# Altium schematic sheet DC-DC-Converters 3.SchDoc
size A3
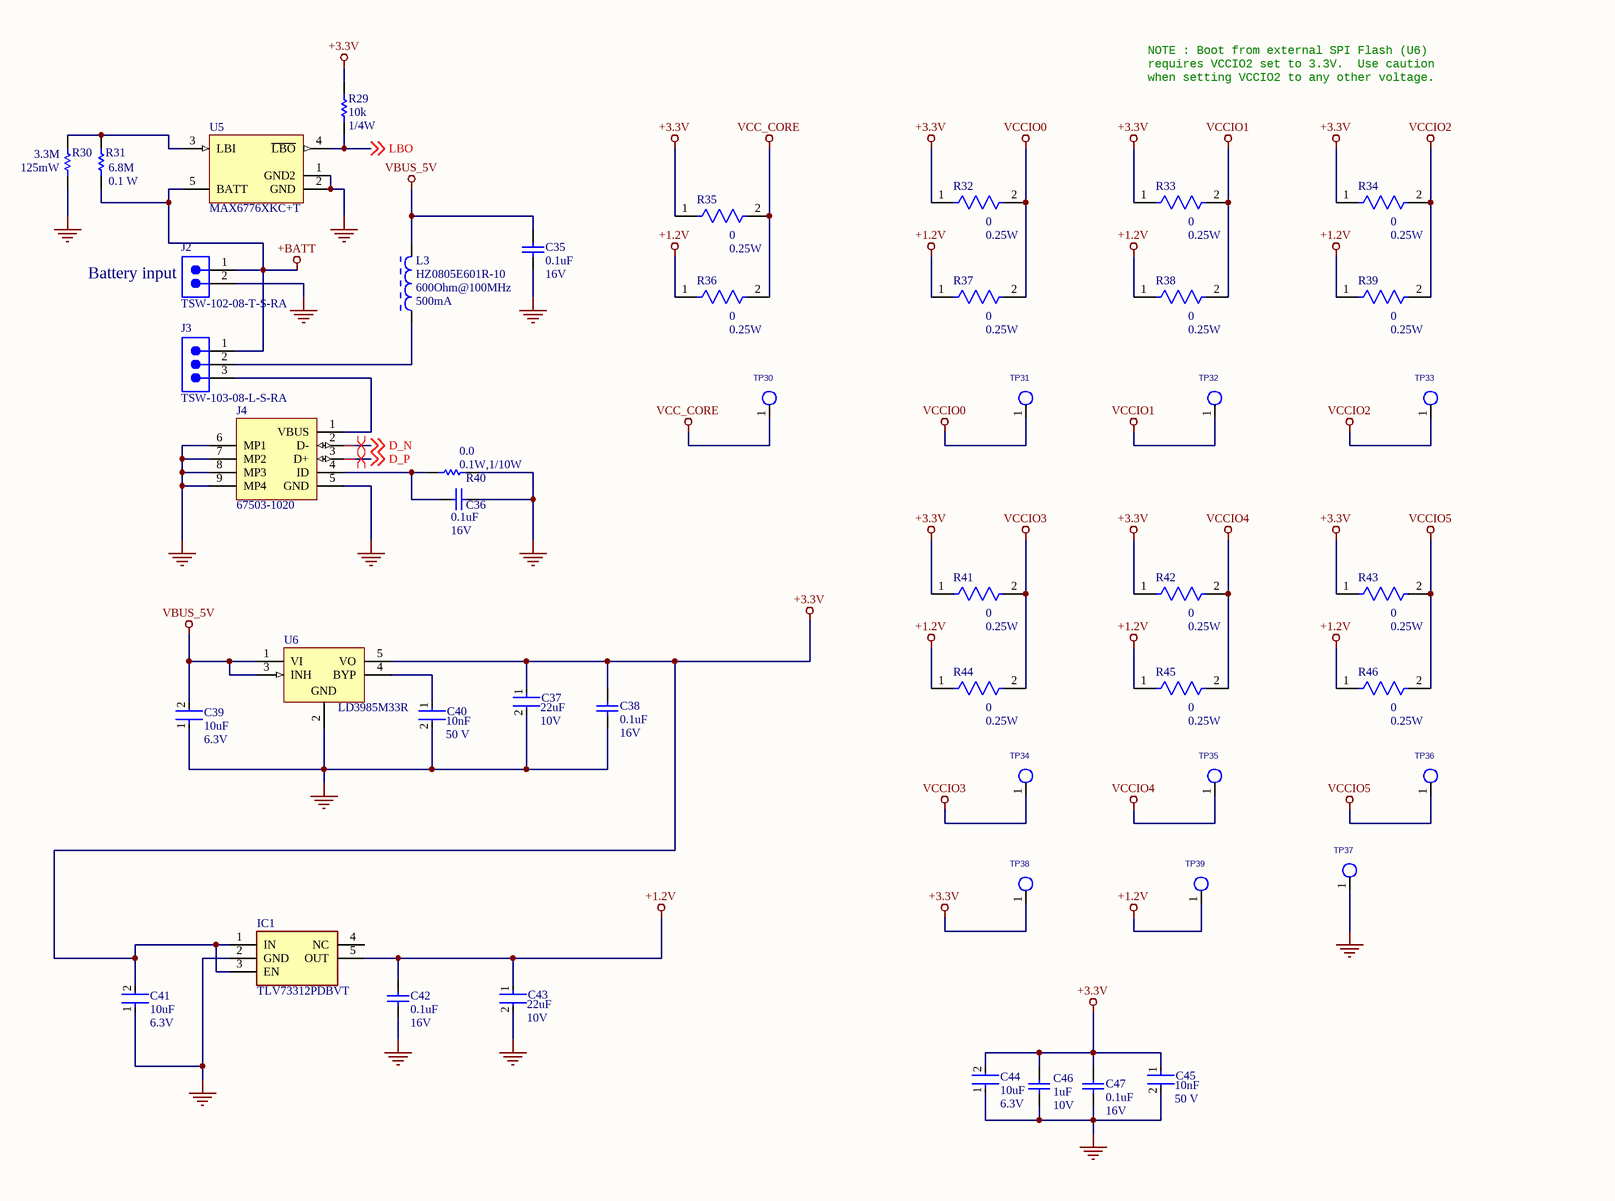
[diagram p0: DC-DC-Converters 3.SchDoc]

## Parts
C35  value 0.1uF  Voltage: 16V  [CAPC1608X87X35ML15T15]  (hidden comment: C0603C104M4RACTU)
C36  value 0.1uF  Voltage: 16V  [CAPC1608X87X35ML15T15]  (hidden comment: C0603C104M4RACTU)
C37  value 22uF  Voltage: 10V  [FP-GRM188-0_2-IPC_C]  (hidden comment: GRM188R61A226ME15D)
C38  value 0.1uF  Voltage: 16V  [CAPC1608X87X35ML15T15]  (hidden comment: C0603C104M4RACTU)
C39  value 10uF  Voltage: 6.3V  [FP-CL10-IPC_C]  (hidden comment: CL10A106MQ8NNNC)
C40  value 10nF  Voltage: 50 V  [FP-C0805C-DN-MFG]  (hidden comment: C0805C103K5RACAUTO)
C41  value 10uF  Voltage: 6.3V  [FP-CL10-IPC_C]  (hidden comment: CL10A106MQ8NNNC)
C42  value 0.1uF  Voltage: 16V  [CAPC1608X87X35ML15T15]  (hidden comment: C0603C104M4RACTU)
C43  value 22uF  Voltage: 10V  [FP-GRM188-0_2-IPC_C]  (hidden comment: GRM188R61A226ME15D)
C44  value 10uF  Voltage: 6.3V  [FP-CL10-IPC_C]  (hidden comment: CL10A106MQ8NNNC)
C45  value 10nF  Voltage: 50 V  [FP-C0805C-DN-MFG]  (hidden comment: C0805C103K5RACAUTO)
C46  value 1uF  Voltage: 10V  [CAPC1608X90X35ML15T15]  (hidden comment: C0603C105K8RACTU)
C47  value 0.1uF  Voltage: 16V  [CAPC1608X87X35ML15T15]  (hidden comment: C0603C104M4RACTU)
IC1  TLV73312PDBVT  [SOT95P280X145-5N]
J2  TSW-102-08-T-S-RA  [SMTC-TSW-102-08-X-S-RA]
J3  TSW-103-08-L-S-RA  [SMTC-TSW-103-08-X-S-RA]
J4  67503-1020  [MOLX-67503-1020_V]
L3  HZ0805E601R-10  Impedance @ Frequency: 600Ohm@100MHz  Current Rating (Max): 500mA  [LIRD-LI0805H151R-10-2_V]
R29  value 10k  Power: 1/4W  [RESC3216X70X50NL05T20]  (hidden comment: ERJ-8GEYJ103V)
R30  value 3.3M  Power: 125mW  [RESC2013X50X30LL20T20]  (hidden comment: CRCW08053M30FKEA)
R31  value 6.8M  Power: 0.1 W  [RESC0603(1608)_L]  (hidden comment: 6M8 5% 0603(1608))
R32  value 0  Power: 0.25W  [FP-RC1206-MFG]  (hidden comment: RC1206JR-070RL)
R33  value 0  Power: 0.25W  [FP-RC1206-MFG]  (hidden comment: RC1206JR-070RL)
R34  value 0  Power: 0.25W  [FP-RC1206-MFG]  (hidden comment: RC1206JR-070RL)
R35  value 0  Power: 0.25W  [FP-RC1206-MFG]  (hidden comment: RC1206JR-070RL)
R36  value 0  Power: 0.25W  [FP-RC1206-MFG]  (hidden comment: RC1206JR-070RL)
R37  value 0  Power: 0.25W  [FP-RC1206-MFG]  (hidden comment: RC1206JR-070RL)
R38  value 0  Power: 0.25W  [FP-RC1206-MFG]  (hidden comment: RC1206JR-070RL)
R39  value 0  Power: 0.25W  [FP-RC1206-MFG]  (hidden comment: RC1206JR-070RL)
R40  value 0.0  Power: 0.1W,1/10W  [RESC1608X55X35LL10T10]  (hidden comment: RC1608J000CS)
R41  value 0  Power: 0.25W  [FP-RC1206-MFG]  (hidden comment: RC1206JR-070RL)
R42  value 0  Power: 0.25W  [FP-RC1206-MFG]  (hidden comment: RC1206JR-070RL)
R43  value 0  Power: 0.25W  [FP-RC1206-MFG]  (hidden comment: RC1206JR-070RL)
R44  value 0  Power: 0.25W  [FP-RC1206-MFG]  (hidden comment: RC1206JR-070RL)
R45  value 0  Power: 0.25W  [FP-RC1206-MFG]  (hidden comment: RC1206JR-070RL)
R46  value 0  Power: 0.25W  [FP-RC1206-MFG]  (hidden comment: RC1206JR-070RL)
TP30  tp_s_40_63  [tp_s_40_63]  (value not drawn)
TP31  tp_s_40_63  [tp_s_40_63]  (value not drawn)
TP32  tp_s_40_63  [tp_s_40_63]  (value not drawn)
TP33  tp_s_40_63  [tp_s_40_63]  (value not drawn)
TP34  tp_s_40_63  [tp_s_40_63]  (value not drawn)
TP35  tp_s_40_63  [tp_s_40_63]  (value not drawn)
TP36  tp_s_40_63  [tp_s_40_63]  (value not drawn)
TP37  tp_s_40_63  [tp_s_40_63]  (value not drawn)
TP38  tp_s_40_63  [tp_s_40_63]  (value not drawn)
TP39  tp_s_40_63  [tp_s_40_63]  (value not drawn)
U5  MAX6776XKC+T  [X5+1_N]
U6  LD3985M33R  [SOT23-5L_N]

## Nets
+1.2V: C42.1 C43.1 IC1.5(OUT) R36.1 R37.1 R38.1 R39.1 R44.1 R45.1 R46.1 TP39.1(TP)
+3.3V: C37.1 C38.1 C41.2 C44.2 C45.1 C46.2 C47.1 IC1.1(IN) IC1.3(EN) R29.1 R32.1 R33.1 R34.1 R35.1 R41.1 R42.1 R43.1 TP38.1(TP) U6.5(VO)
+BATT: J2.1 J3.1 R31.1 U5.5(BATT)
GND: C35.2 C36.1 C37.2 C38.2 C39.1 C40.2 C41.1 C42.2 C43.2 C44.1 C45.2 C46.1 C47.2 IC1.2(GND) J2.2 J4.5(GND) J4.6(MP1) J4.7(MP2) J4.8(MP3) J4.9(MP4) R30.1 R40.2 TP37.1(TP) U5.1(GND2) U5.2(GND) U6.2(GND)
VBUS_5V: C35.1 C39.2 L3.2 U6.1(VI) U6.3(INH)
VCC_CORE: R35.2 R36.2 TP30.1(TP)
VCCIO0: R32.2 R37.2 TP31.1(TP)
VCCIO1: R33.2 R38.2 TP32.1(TP)
VCCIO2: R34.2 R39.2 TP33.1(TP)
VCCIO3: R41.2 R44.2 TP34.1(TP)
VCCIO4: R42.2 R45.2 TP35.1(TP)
VCCIO5: R43.2 R46.2 TP36.1(TP)
D_N: J4.2(D-) ; off-sheet D_N
D_P: J4.3(D+) ; off-sheet D_P
LBO: R29.2 U5.4(~{LBO}) ; off-sheet LBO
NetC36_2: C36.2 J4.4(ID) R40.1
NetC40_1: C40.1 U6.4(BYP)
NetJ3_2: J3.2 L3.1
NetJ3_3: J3.3 J4.1(VBUS)
NetR30_2: R30.2 R31.2 U5.3(LBI)

Not connected (* = marked no-connect by the designer): IC1 4(NC)

## Layout directives
differential pair; differential pair class USB; rule Differential Pairs Routing [Pref Gap = 10mil    Min Gap  = 10mil    Max Gap  = 10milPref Width = 14.334mil    Min Width  = 14.334mil    Max Width  = 15mil]: D_N, D_P

## Notes on the sheet
- NOTE : Boot from external SPI Flash (U6)
  requires VCCIO2 set to 3.3V.  Use caution
  when setting VCCIO2 to any other voltage.
- (near J2) Battery input
- Title
- Size:
- Date:
- A3
- Number:
- Time:
- Revision:
- Sheet
- of
- File:

## Library data of the parts
C35 C36 C38 C42 C47 = CMP-2006-03067-1: Ceramic Capacitor 0.1uF 16V +-10% X7R0603; Manufacturer: Kemet; Alternative1: C1608X7R1E104K TDK; Alternative2: CC0603KRX7R8BB104 Yageo; Alternative3: GRM188R72A104KA35D Murata; Part Number: C0603C104M4RACTU; Package / Case: 0603
C37 C43 = CMP-06035-000033-2: Chip Multilayer Ceramic Capacitors for General Purpose, 0603, 22uF, X5R, 15%, 20%, 10V; Alternative1: GRM21BR72A103KA01L Murata; Alternative2: C0805F103K5RACTU KEMET; Alternative3: 08055C103JAT2A Kyocera AVX; Tolerance: 20%; Material: Ceramic; Termination: SMD/SMT; Packaging: Tape and Reel; Width: 0.8mm; Case Code (Imperial): 0603; Mount: Surface Mount; Package / Case: 0603; Dielectric: X5R; Package Quantity: 4000; Case Code (Metric): 1608; Min Operating Temperature: -55°C; Lead Free: Lead Free; Max Operating Temperature: 85°C; Part Number: GRM188R61A226ME15D
C39 C41 C44 = CMP-13271-001938-1: Cap Ceramic 10uF 6.3V X5R ±20% Pad SMD 0603 +85°C T/R; Manufacturer: Samsung; Alternative1: LMK107BJ106MALTD Taiyo Yuden; Alternative2: C1608X5R0J106K080AB TDK; Alternative3: 06036D106MAT2A Kyocera AVX; Height: 0.8mm; Width: 0.031inch; Min Operating Temperature: -55°C; Dielectric: X5R; Package / Case: 0603; Radiation Hardening: No; Packaging: Tape and Reel; Max Operating Temperature: 85°C; Thickness: 0.035inch; Mount: Surface Mount; Case Code (Imperial): 0603; Case Code (Metric): 1608; Depth: 0.8mm; Tolerance: 20%; Length: 1.6mm; Part Number: CL10A106MQ8NNNC
C40 C45 = CMP-03020-006206-1: CAP CER 10000PF 50V X7R 0805; Manufacturer: KEMET; Material: Ceramic; Temperature Coefficient: 30ppm/°C; Alternative1: GRM21BR72A103KA01L Murata; Alternative2: C0805F103K5RACTU KEMET; Alternative3: 08055C103JAT2A Kyocera AVX; Height: 0.88mm; Temperature Characteristic: X7R; Part Number: C0805C103K5RACAUTO; ComponentLink2URL: https://content.kemet.com/datasheets/KEM_C1003_C0G_SMD.pdf; RoHS: TRUE; Temperature: -55°C to +125°C; Temperature Range Low: -55°C; ComponentLink2Description: Datasheet; Package / Case: C0805C-DN; Lead Free: Yes
C46 = CMP-2006-02293-1: Manufacturer: Kemet; Alternative1: CL10B105KO8NNND Samsung; Alternative2: CC0603KPX7R7BB105 Yageo; Alternative3: GRM188R71C105KE15D Murata; Part Number: C0603C105K8RACTU; Package / Case: 0603
IC1 = TLV73312PDBVT: Integrated Circuit; Manufacturer_Name: Texas Instruments; Datasheet Link: http://www.ti.com/lit/gpn/TLV733P; Height: 1.45mm; Manufacturer_Part_Number: TLV73312PDBVT; Arrow Part Number: TLV73312PDBVT; Arrow Price/Stock: https://www.arrow.com/en/products/tlv73312pdbvt/texas-instruments; Mouser Part Number: 595-TLV73312PDBVT; Mouser Price/Stock: https://www.mouser.co.uk/ProductDetail/Texas-Instruments/TLV73312PDBVT?qs=ifm8N2KdrcbA2G38xADqCw%3D%3D
J2 = CMP-1024-00319-1: 0.025" SQ Post Header, Through-hole, Right Angle, -55 to 105 degC, 2.54 mm Pitch, 2-Pin, Male, RoHS; Manufacturer: Samtec; Pitch: 2.54 mm; ComponentLink1Description: Manufacturer URL; ComponentLink1URL: http://www.samtec.com; ComponentLink2Description: Datasheet; ComponentLink2URL: http://www.samtec.com/documents/webfiles/pdf/TSW_TH.PDF; Mounting Technology: Through-hole; Temperature Range: -55 to 105 degC; PackageDescription: .025[0.64] SQ. Post Terminal Strip Assembly; PackageVersion: DM, 8/1988; PartNumber: TSW-102-08-T-S-RA; Orientation: Right Angle; ComponentLink3URL: http://www.samtec.com/documents/webfiles/cpdf/TSW-XXX-XX-XXX-X-XX-XXX-MKT.pdf; RoHS: True; ComponentLink3Description: Package Specification; DatasheetVersion: F-214; PackageReference: TSW-102-08-X-S-RA
J3 = CMP-1024-00343-1: 0.025" SQ Post Header, Through-hole, Right Angle, -55 to 125 degC, 2.54 mm Pitch, 3-Pin, Male, RoHS; Manufacturer: Samtec; Pitch: 2.54 mm; ComponentLink2Description: Datasheet; Temperature Range: -55 to 125 degC; ComponentLink1Description: Manufacturer URL; Mounting Technology: Through-hole; ComponentLink3URL: http://www.samtec.com/documents/webfiles/cpdf/TSW-XXX-XX-XXX-X-XX-XXX-MKT.pdf; DatasheetVersion: F-214; PackageDescription: .025[0.64] SQ. Post Terminal Strip Assembly; PackageVersion: DM, 8/1988; Orientation: Right Angle; PackageReference: TSW-103-08-X-S-RA; ComponentLink1URL: http://www.samtec.com; ComponentLink3Description: Package Specification; PartNumber: TSW-103-08-L-S-RA; RoHS: True; ComponentLink2URL: http://www.samtec.com/documents/webfiles/pdf/TSW_TH.PDF
J4 = CMP-0411-00002-1: USB, MINI, SMD, RA KME04-USBMU03A01; Manufacturer: Molex; ComponentLink1URL: http://www.molex.com/; Part Number: 67503-1020; Mounting Technology: Surface Mount; ComponentLink1Description: Manufacturer URL; Terminal Pitch: 0.8 mm; DatasheetVersion: Rev F, 06/2009; ComponentLink2Description: Datasheet; PackageDescription: Mini USB Connector, SMT, Righer Angle; ComponentLink2URL: http://www.molex.com/pdm_docs/sd/675031020_sd.pdf; PackageReference: 67503-1020
L3 = CMP-2000-05194-1: Chip Bead for Signal Filtering, 600 Ohm, 500 mA, -40 to 125 degC, 0805 (2012 Metric), RoHS, Tape and Reel; Manufacturer: Laird; Other Names: 240-2399-1; Kits: 240-2227-ND-KITEMIFERRITEBEADCHIPSMD; DC Resistance (DCR) (Max): 300mOhm; Filter Type: SignalLine; Operating Temperature: -40degC~125degC; Datasheet URL: https://datasheet.ciiva.com/22622/1685710-22622833.pdf; Mounting Type: SurfaceMount; Package / Case: 0805(2012Metric); Package Description: 2-Pin Surface Mount Device, Body 2 x 1.25 mm; Package Reference: LI0805H15R-10-2; Size / Dimension: 0.079"Lx0.049"W(2.00mmx1.25mm); Height (Max): 0.043"(1.10mm); Part Number: HZ0805E601R-10
R29 = CMP-2003-00545-1: Res Thick Film 1206 10k Ohms 5% 1/4W; Manufacturer: Panasonic; Alternative1: CR1206F-10KFI TT Welwyn; Alternative2: WR12X1002FGL Walsin Technologies; Alternative3: CR1206-FX-1002ELF Bourns; Part Number: ERJ-8GEYJ103V; Package / Case: 1206
R30 = CMP-2001-03892-1: Manufacturer: Vishay Dale; Alternative1: CRCW08050000Z0EA Vishay; Alternative2: CRCW080512K0FKEA Vishay; Alternative3: CRCW08054K70FKEA Vishay; Part Number: CRCW08053M30FKEA; Package / Case: 0805
R31 = CMP-1012-00166-1: 6M8 0.1W 5% 0603 (1608 Metric)  SMD; Part Number: ERJ-3GEYJ685V; Alternative1: CR0603-JW-685ELF; Alternative2: RMCF0603JT6M80 Stackpole Electronics; Alternative3: CRCW06036M80JNEA Vishay Dale; Package / Case: 0603; Tolerance: 5 %
R32-R39 R41-R46 = CMP-03412-007570-1: RES SMD 0 OHM JUMPER 1/4W 1206; Manufacturer: YAGEO; Voltage Rating: 200V; Temperature Coefficient: 300ppm/°C; Tolerance: 5%; Alternative1: RC1206JR-100R Yageo; Alternative2: ERJ8GEY0R00V Panasonic; Alternative3: CRCW12060000Z0EC Vishay Dale; Part Number: RC1206JR-070RL; Temperature: -55°C to +155°C; ComponentLink2URL: https://www.yageo.com/upload/media/product/productsearch/datasheet/rchip/PYu-RC_Group_51_RoHS_L_10.pdf; Lead Free: Yes; Height: 0.65mm; Package / Case: 1206; ComponentLink2Description: Datasheet; Composition: Thick Film; RoHS: TRUE
R40 = CMP-2000-06972-1: Chip Resistor, 0 Ohm, +/- 5%, 0.1 W, -55 to 155 degC, 0603 (1608 Metric), RoHS, Tape and Reel; Manufacturer: Samsung-Electro-Mechanics-America,-Inc.; Tolerance: Jumper; Alternative1: RC0603JR-130RL Yageo; Alternative2: RC0603JR-100RL Yageo; Alternative3: CRCW0603-0000Z0EA Vishay; Manufacturer URL: http://www.samsungsem.com/global/index.jsp; Features: MoistureResistant; Mounting Technology: SurfaceMount; Series: RC; Package / Case: 0603(1608Metric); Category: Resistors; Operating Temperature: -55°C~155°C; Datasheet URL: http://static6.arrow.com/aropdfconversion/3cece72dd289ffbadc164fbcd05f638dd7240f7b/rc_datasheet_150330.pdf.pdf?authToken=eyJ0eXAiOiJKV1QiLCJhbGciOiJIUzI1NiJ9.eyJTZXNzaW9uSWQiOiJtY3ZlYXdxYmptZXdpdXdyeG1ha2FxdWciLCJEb3dubG9hZFR5cGUiOiJEYXRhc2hlZXRzIiwiaXNzIjoic2VsZiIsImF1ZCI6Imh0dHA6Ly9kYXRhc2hlZXRhdXRoLmFycm93LmNvbSIsImV4cCI6MTQ3Njg1OTQ5NiwibmJmIjoxNDc2ODU5Mzc2fQ.1rZWSrRNyHkP6J5YmszFzS2kzmlbN9BKNvWJ4ACiP-Q; Datasheet Version: 09/2015; Composition: ThickFilm; Package Description: 2-Pin Chip Resistor, Body 1.6 x 0.8 mm; Height: 0.022"(0.55mm); Family: ChipResistor-SurfaceMount; Temperature Coefficient: -; Size / Dimension: 0.063"Lx0.031"W(1.60mmx0.80mm); Part Number: RC1608J000CS
TP30-TP39 = TP_S_40_63: Square test point, 40mil inner diameter, 63mil outer diameter; Assy: DNI; Class: IO
U5 = CMP-0251-00617-1: Low-Power, 1%-Accurate Battery Monitor, Single LBO output, Open-Drain output, Fixed hysteresis, 5-Pin SC70, -40°C to +85°C, Pb-Free, Tape and Reel; PackageVersion: revE, 2006; PackageDescription: 5-Pin SC70 Transistor Package, 0.65 mm Pitch, 2.2 mm Lead Span; ComponentLink1URL: http://www.maxim-ic.com; ComponentLink2URL: http://datasheets.maxim-ic.com/en/ds/MAX6775-MAX6781.pdf; ComponentLink2Description: Datasheet; ComponentLink3URL: http://pdfserv.maxim-ic.com/package_dwgs/21-0076.PDF; ComponentLink1Description: Manufacturer URL; ComponentLink3Description: Package Specification; PackageReference: X5+1; DatasheetVersion: Rev 4, May-2009; Code_JEDEC: MO-203
U6 = CMP-0244-00328-1: 150mA, Ultra-Low Drop Low Noise BiCMOS Voltage Regulators Low ESR Capacitors Compatible, 3.3V, 5-Pin SOT23-5L; ComponentLink1Description: Manufacturer URL; ComponentLink2URL: http://www.st.com/internet/com/TECHNICAL_RESOURCES/TECHNICAL_LITERATURE/DATASHEET/CD00003395.pdf; PackageReference: SOT23-5L; ComponentLink1URL: http://www.st.com; ComponentLink2Description: Datasheet; PackageVersion: 1/01/2008; PackageDescription: 5-Pin SOT-23 Package, 2.9 x 1.6 mm Body, 0.95 mm Pitch, 2.8 mm Lead Span; DatasheetVersion: 3/01/2011